# EasyEDA Pro project 原理图.epro

# Schematic Link-Card
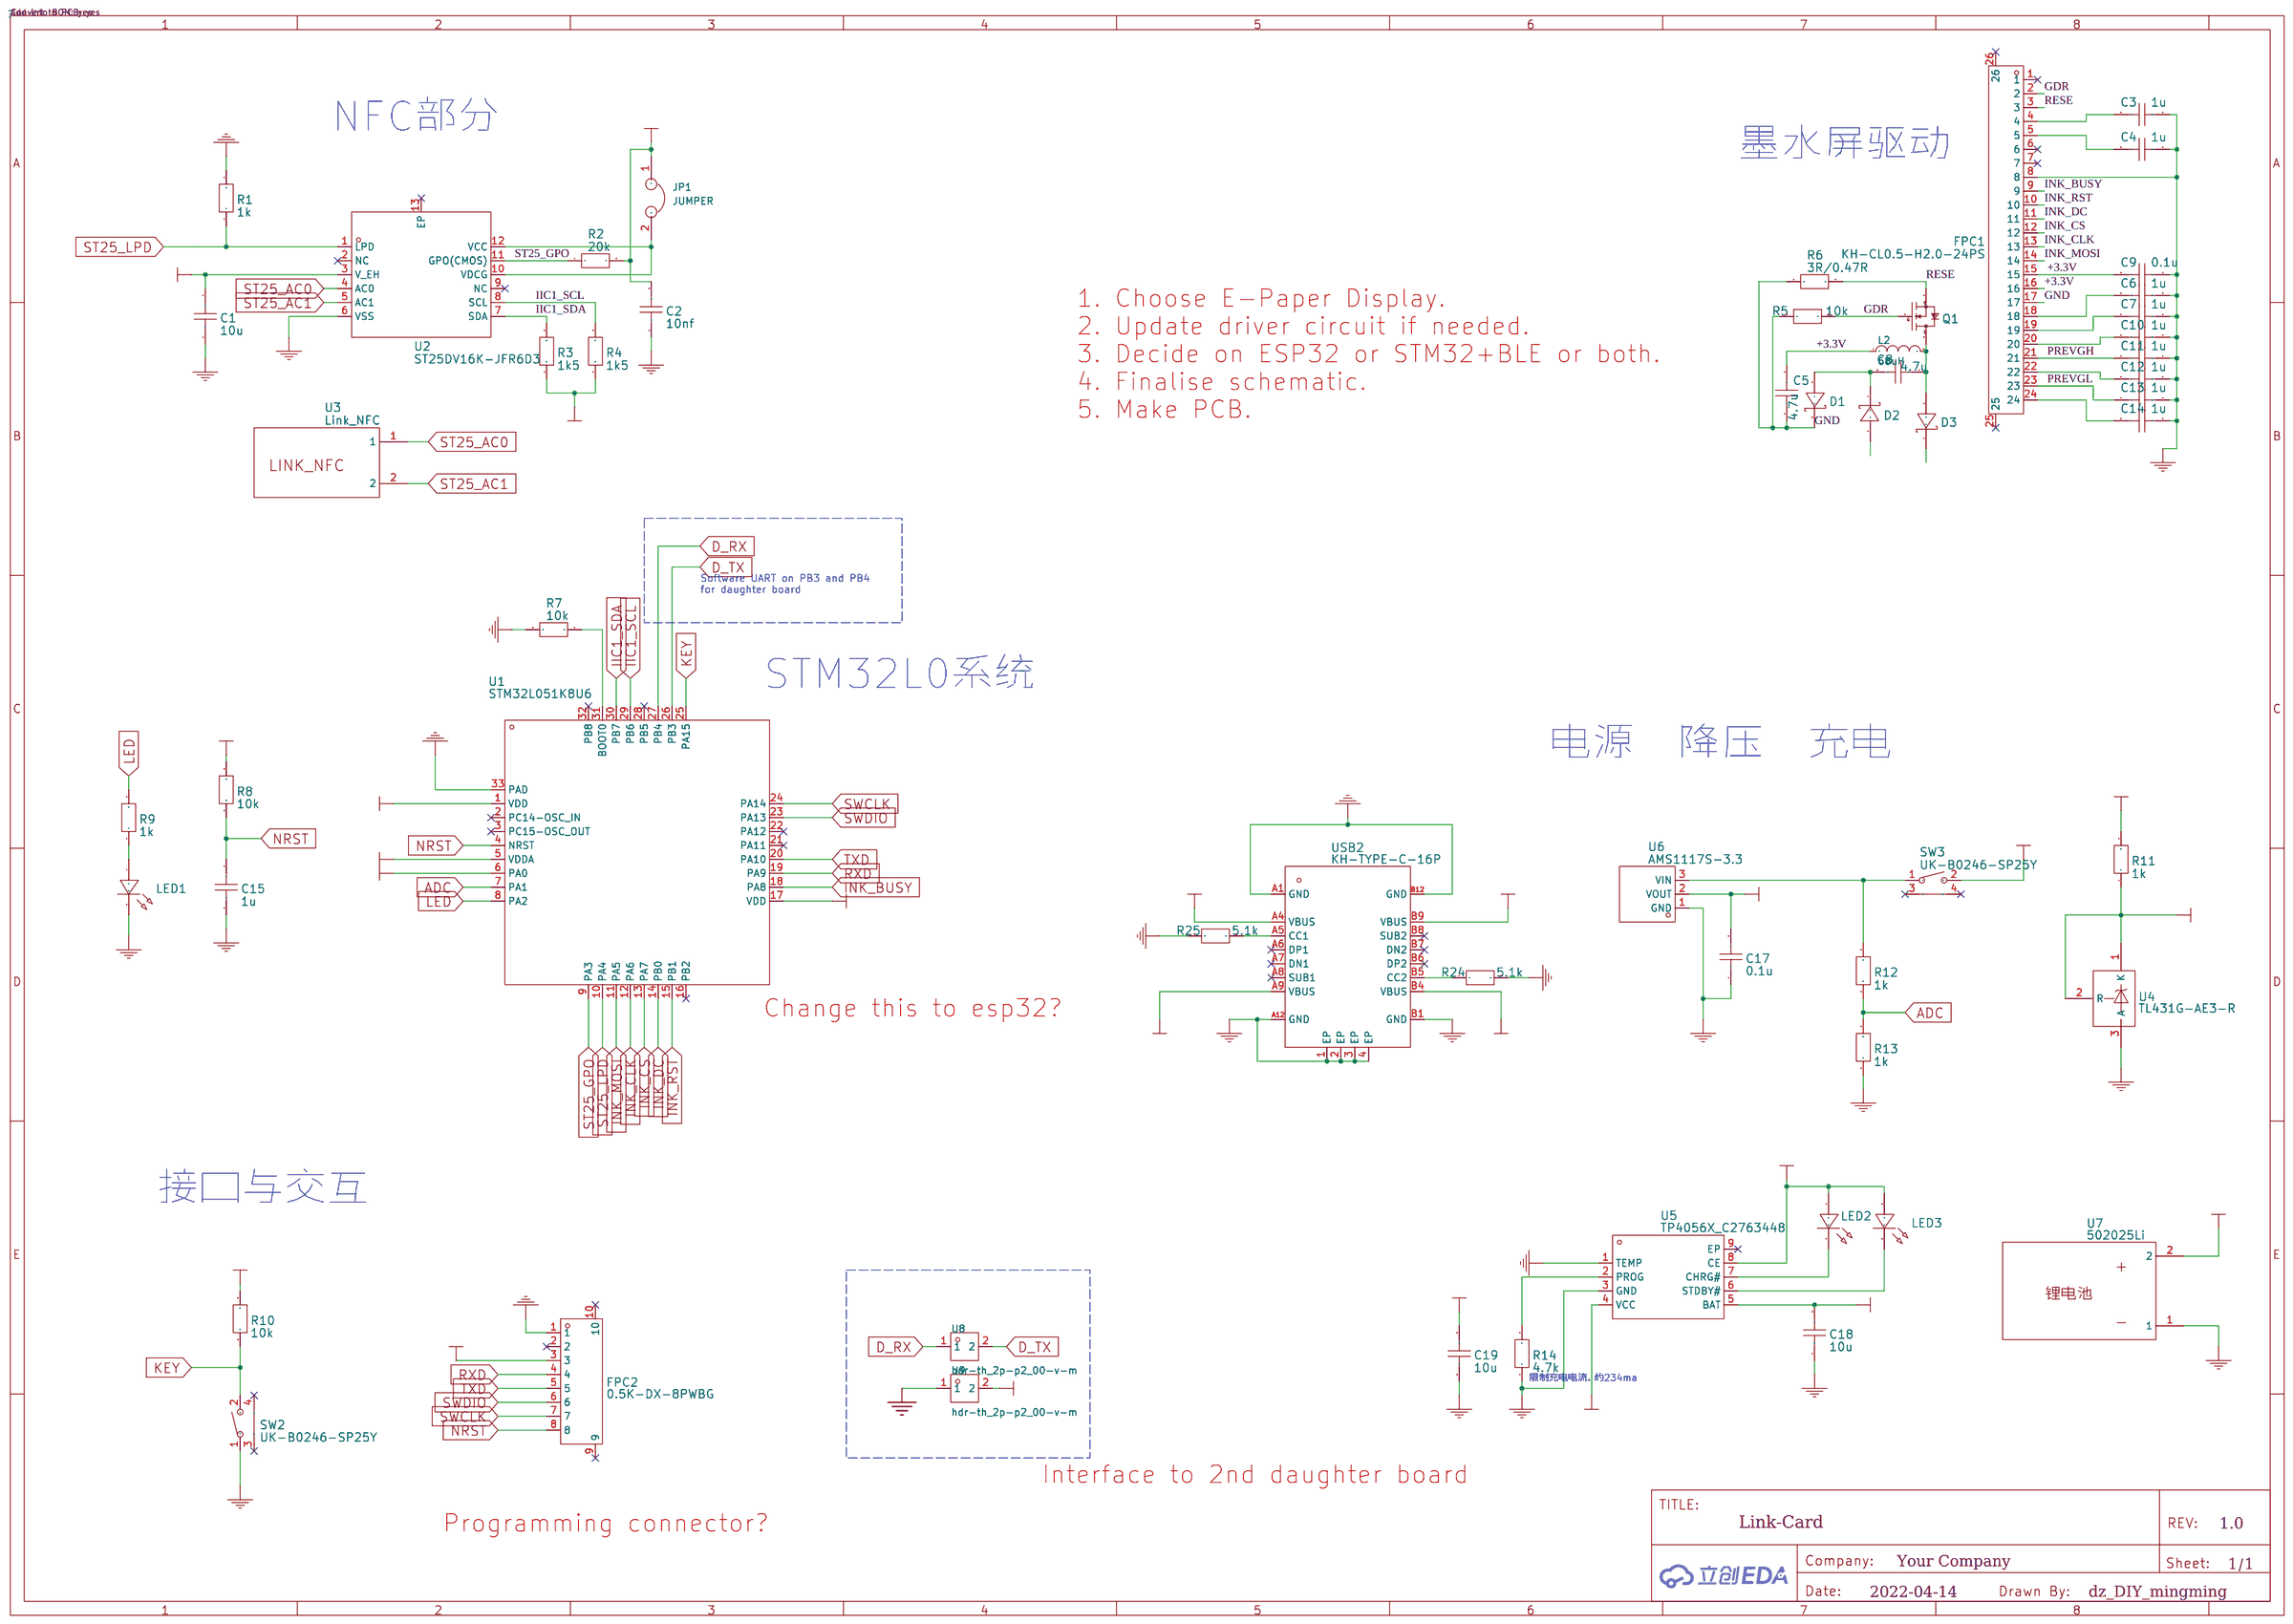
[diagram p0: schematic sheet]

## Parts
C1  10u  [C0805]
C2  10nf  [C0603]
C3  1u  [C0603]
C4  1u  [C0603]
C5  4.7u  [C0603]
C6  1u  [C0603]
C7  1u  [C0603]
C8  4.7u  [C0603]
C9  0.1u  [C0603]
C10  1u  [C0603]
C11  1u  [C0603]
C12  1u  [C0603]
C13  1u  [C0603]
C14  1u  [C0603]
C15  1u  [C0603]
C17  0.1u  [C0603]
C18  10u  [C0805]
C19  10u  [C0805]
D1  MBR0530  [SOD-123F_L2.7-W1.7-LS3.7-RD-1]
D2  MBR0530  [SOD-123F_L2.7-W1.7-LS3.7-RD-1]
D3  MBR0530  [SOD-123F_L2.7-W1.7-LS3.7-RD-1]
FPC1  KH-CL0.5-H2.0-24PS  [FPC-SMD_24P-P0.50_KINGHELM_KH-CL0.5-H2.0-24PS]
FPC2  0.5K-DX-8PWBG  [FPC-SMD_8P-P0.50_HDGC_0.5K-DX-8PWBG]
JP1  JUMPER  [JUMPER-0603]
L2  68uH  [IND-SMD_L5.8-W5.2]
LED1  LED-0805_B  [LED0805_BLUE]
LED2  LED-0805_R  [LED0805_RED]
LED3  LED-0805_G  [LED0805_GREEN]
Q1  MOSFET-N+SI1304BDL  [SOT-323-3_L2.0-W1.3-P1.30-LS2.1-BR]
R1  1k  [R0603]
R2  20k  [R0603]
R3  1k5  [R0603]
R4  1k5  [R0603]
R5  10k  [R0603]
R6  3R/0.47R  [R0603]
R7  10k  [R0603]
R8  10k  [R0603]
R9  1k  [R0603]
R10  10k  [R0603]
R11  1k  [R0603]
R12  1k  [R0603]
R13  1k  [R0603]
R14  4.7k  [R0603]
R24  5.1k  [R0603]
R25  5.1k  [R0603]
SW2  UK-B0246-SP25Y  [SW-SMD_UK-B0246-SP25Y]
SW3  UK-B0246-SP25Y  [SW-SMD_UK-B0246-SP25Y]
U1  STM32L051K8U6  [UFQFPN-32_L5.0-W5.0-P0.50-BL-EP]
U2  ST25DV16K-JFR6D3  [DFN-12_L3.0-W3.0-P0.50-LS3.0-BL-EP]
U3  Link_NFC  [LINK_NFC]
U4  TL431G-AE3-R  [SOT-23-3_L2.9-W1.3-P1.90-LS2.4-TR]
U5  TP4056X_C2763448  [SOP-8_L4.9-W3.9-P1.27-LS6.0-TL-EP-1]
U6  AMS1117S-3.3  [SOT-89-3_L4.5-W2.5-P1.50-LS4.2-BR]
U7  502025Li  [502025LI]
U8  hdr-th_2p-p2_00-v-m  [HDR-TH_2P-P2.00-V-M-1]
U9  hdr-th_2p-p2_00-v-m  [HDR-TH_2P-P2.00-V-M-1]
USB2  KH-TYPE-C-16P  [USB-C-SMD_KH-TYPE-C-16P]

## Library data of the parts
C1 C18 C19 = 10u
C2 = 10nf
C3 C4 C6 C7 C10-C15 = 1u
C5 C8 = 4.7u
C9 C17 = 0.1u
D1-D3 = MBR0530: Supplier: LCSC; Supplier Part: C77336
FPC1 = KH-CL0.5-H2.0-24PS: Supplier: LCSC; Supplier Part: C2833365; Manufacturer: kinghelm(金航标); JLCPCB Part Class: Extended Part
FPC2 = 0.5K-DX-8PWBG: Supplier: LCSC; Supplier Part: C2911880; Manufacturer: HDGC(华德共创); JLCPCB Part Class: Extended Part
JP1 = JUMPER
L2 = CY54-68UH: 电感值:68uH;精度:±10%;额定电流:600mA;饱和电流(Isat):-;直流电阻(DCR):390mΩ;; LCSC Part Name: 68uH ±10% 390mΩ; Supplier Part: C2929435; Manufacturer: SHOU HAN(首韩); Supplier Footprint: SMD,5.2x5.8mm; JLCPCB Part Class: Extended Part; Datasheet: https://atta.szlcsc.com/upload/public/pdf/source/20211213/2CA85409B3B1311983E9E122C3568FF5.pdf; Supplier: LCSC; Tolerance: ±10%; Rated Current: 600mA; DC Resistance (DCR): 390mΩ
LED1 = LED-0805_B: Manufacturer: 方舟 ARKLED; Manufacturer Part: D-B080508B1-KS2; Supplier Part: C108412
LED2 = LED-0805_R: Manufacturer: EVERLIGHT(台湾亿光); Manufacturer Part: 17-21SURC/S530-A3/TR8; Supplier Part: C72037
LED3 = LED-0805_G: Manufacturer: 国星光电; Manufacturer Part: NCD0805G1; Supplier Part: C84260
Q1 = MOSFET-N+SI1304BDL: IRLL014:; Manufacturer Part: ?
R1 R9 R11-R13 = 1k
R2 = 20k
R3 R4 = 1k5
R5 R7 R8 R10 = 10k
R6 = 3R/0.47R
R14 = 4.7k
R24 R25 = 5.1k
SW2 SW3 = UK-B0246-SP25Y: Supplier: LCSC; Supplier Part: C493279; Manufacturer: USAKRO; JLCPCB Part Class: Extended Part
U1 = STM32L051K8U6: Supplier: LCSC; Manufacturer: STMicroelectronics; Supplier Part: C94770; JLCPCB Part Class: Extended Part
U2 = ST25DV16K-JFR6D3: Supplier: LCSC; Supplier Part: C2762854; Manufacturer: null; JLCPCB Part Class: Extended Part
U3 = Link_NFC
U4 = TL431G-AE3-R: Supplier: LCSC; Manufacturer: UTC; Supplier Part: C71130; JLCPCB Part Class: Extended Part
U5 = TP4056X_C2763448: Supplier: LCSC; Supplier Part: C2763448; Manufacturer: TOPPOWER(南京拓微); Manufacturer Part: TP4056X; JLCPCB Part Class: Extended Part
U6 = AMS1117S-3.3: Supplier: LCSC; Supplier Part: C917152; Manufacturer: JSMSEMI
U7 = 502025Li
U8 U9 = hdr-th_2p-p2_00-v-m: Supplier Part: C9900015197; Supplier Footprint: CON2_排针; JLCPCB Part Class: Extended Part; Datasheet: https://atta.szlcsc.comnull; Supplier: LCSC
USB2 = KH-TYPE-C-16P: Supplier: LCSC; Supplier Part: C709357; Manufacturer: Shenzhen Kinghelm Elec; JLCPCB Part Class: Extended Part

## Nets
+2.5V: R11.1 U1.6(PA0) U4.1(K) U4.2(R)
+3.3V: C1.2 C2.2 C5.2 C9.1 C17.2 FPC1.15 FPC1.16 FPC2.3 JP1.1 L2.1 R2.2 R3.1 R4.1 R8.2 R10.2 R11.2 U1.1(VDD) U1.5(VDDA) U1.17(VDD) U2.3(V_EH) U6.2(VOUT)
+5V: C19.2 LED2.1 LED3.1 U5.4(VCC) U5.8(CE) USB2.A4(VBUS) USB2.A9(VBUS) USB2.B4(VBUS) USB2.B9(VBUS)
GND: C1.1 C2.1 C3.2 C4.2 C5.1 C6.2 C7.2 C9.2 C10.2 C11.2 C12.2 C13.2 C14.2 C15.1 C17.1 C18.1 C19.1 D1.1(K) FPC1.8 FPC1.17 FPC2.1 LED1.2 R1.2 R5.1 R6.1 R7.2 R13.1 R14.1 R24.2 R25.1 SW2.1 U1.33(PAD) U2.6(VSS) U4.3(A) U5.1(TEMP) U5.3(GND) U6.1(GND) U7.1 U9.1 USB2.1(EP) USB2.2(EP) USB2.3(EP) USB2.4(EP) USB2.A1(GND) USB2.A12(GND) USB2.B1(GND) USB2.B12(GND)
VBAT: C18.2 SW3.2 U5.5(BAT) U7.2 U9.2
ADC: R12.1 R13.2 U1.7(PA1)
D_RX: U1.27(PB4) U8.1
D_TX: U1.26(PB3) U8.2
GDR: FPC1.2 Q1.1(G) R5.2
IIC1_SCL: R4.2 U1.29(PB6) U2.8(SCL)
IIC1_SDA: R3.2 U1.30(PB7) U2.7(SDA)
INK_BUSY: FPC1.9 U1.18(PA8)
INK_CLK: FPC1.13 U1.12(PA6)
INK_CS: FPC1.12 U1.13(PA7)
INK_DC: FPC1.11 U1.14(PB0)
INK_MOSI: FPC1.14 U1.11(PA5)
INK_RST: FPC1.10 U1.15(PB1)
KEY: R10.1 SW2.2 U1.25(PA15)
LED: R9.2 U1.8(PA2)
NRST: C15.2 FPC2.8 R8.1 U1.4(NRST)
PREVGH: C11.1 FPC1.21
PREVGL: C13.1 FPC1.23
RESE: FPC1.3 Q1.2(S) R6.2
RXD: FPC2.4 U1.19(PA9)
ST25_AC0: U2.4(AC0) U3.1
ST25_AC1: U2.5(AC1) U3.2
ST25_GPO: R2.1 U1.9(PA3) U2.11(GPO(CMOS))
ST25_LPD: R1.1 U1.10(PA4) U2.1(LPD)
SWCLK: FPC2.7 U1.24(PA14)
SWDIO: FPC2.6 U1.23(PA13)
TXD: FPC2.5 U1.20(PA10)
Net-(C3-1): C3.1 FPC1.4
Net-(C4-1): C4.1 FPC1.5
Net-(C6-1): C6.1 FPC1.18
Net-(C7-1): C7.1 FPC1.19
Net-(C8-1): C8.1 D3.2(A) L2.2 Q1.3(D)
Net-(C8-2): C8.2 D1.2(A) D2.1(K)
Net-(C10-1): C10.1 FPC1.20
Net-(C12-1): C12.1 FPC1.22
Net-(C14-1): C14.1 FPC1.24
Net-(JP1-2): JP1.2 U2.10(VDCG) U2.12(VCC)
Net-(LED1-1): LED1.1 R9.1
Net-(LED2-2): LED2.2 U5.7(CHRG#)
Net-(LED3-2): LED3.2 U5.6(STDBY#)
Net-(R7-1): R7.1 U1.31(BOOT0)
Net-(R12-2): R12.2 SW3.1 U6.3(VIN)
Net-(R14-2): R14.2 U5.2(PROG)
Net-(R24-1): R24.1 USB2.B5(CC2)
Net-(R25-2): R25.2 USB2.A5(CC1)

Not connected (* = marked no-connect by the designer): D2 2(A); D3 1(K); FPC1 1* 6* 7* 25* 26*; FPC2 2* 9* 10*; SW2 3(EP)* 4(EP)*; SW3 3(EP)* 4(EP)*; U1 2(PC14-OSC_IN)* 3(PC15-OSC_OUT)* 16(PB2)* 21(PA11)* 22(PA12)* 28(PB5)* 32(PB8)*; U2 2(NC)* 9(NC)* 13(EP)*; U5 9(EP)*; USB2 A6(DP1)* A7(DN1)* A8(SUB1)* B6(DP2)* B7(DN2)* B8(SUB2)*

## Notes on the sheet
- NFC部分
- 墨水屏驱动
- 1. Choose E-Paper Display.
  2. Update driver circuit if needed.
  3. Decide on ESP32 or STM32+BLE or both.
  4. Finalise schematic.
  5. Make PCB.
- Software UART on PB3 and PB4
  for daughter board
- STM32L0系统
- 电源  降压  充电
- Change this to esp32?
- 接口与交互
- 限制充电电流，约234ma
- Interface to 2nd daughter board
- Programming connector?
